# EAGLE design Firefly_Pendant (EAGLE 9.6.2)
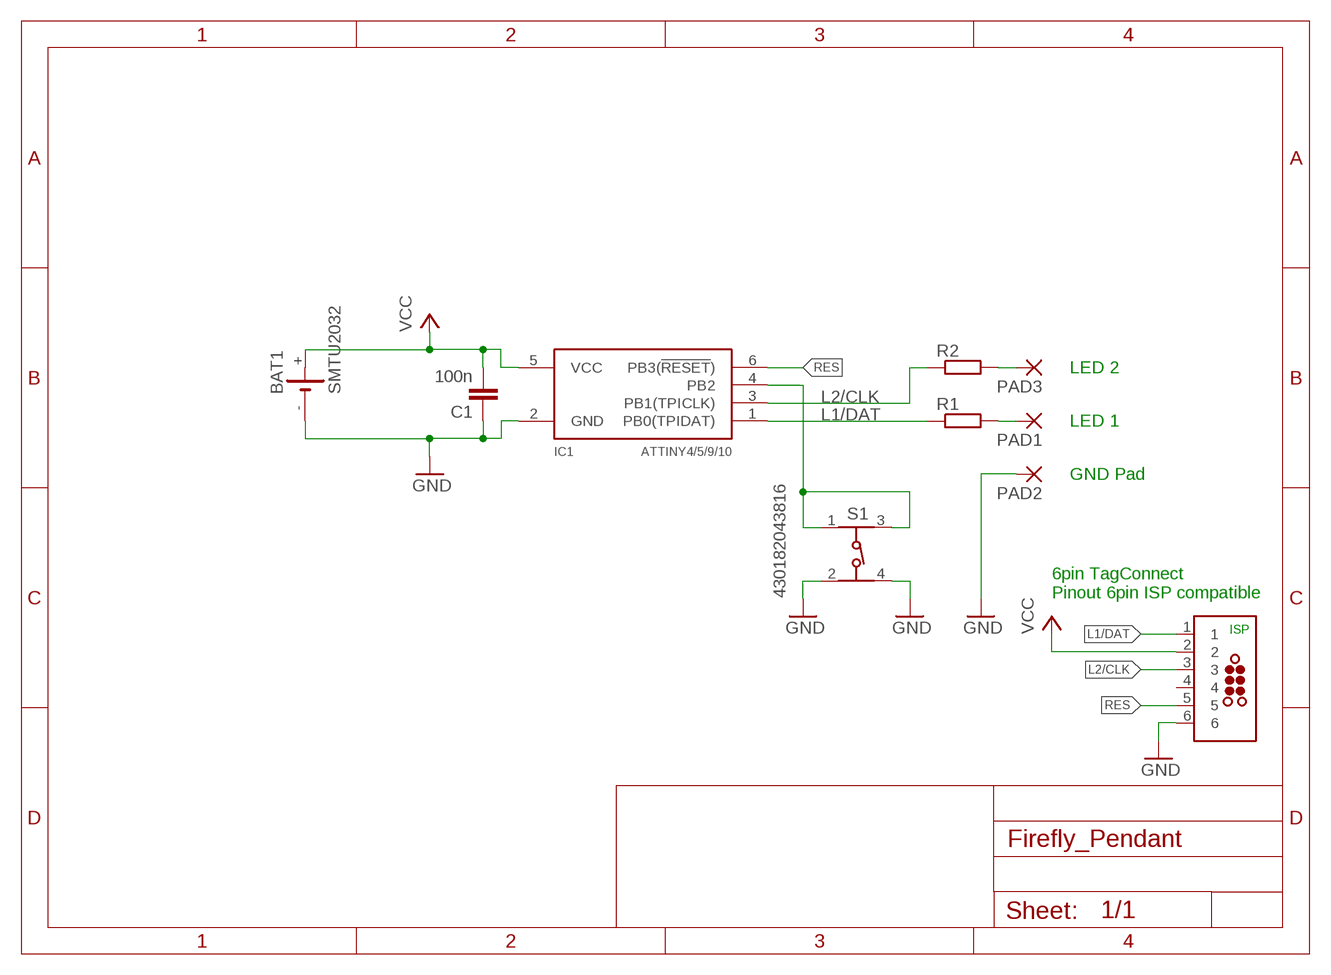
[diagram p0: schematic, sheet 1]

## Parts
BAT1  SMTU2032  [SMTU2032]
C1  100n  C-EUC0603  [C0603]
IC1  ATTINY4/5/9/10  [SOT23-6]
J1  TAG-CONNECT_TC2030-MCP-NL  [TAG-CONNECT_TC2030-MCP-NL]
PAD1  WIREPADSMD1,27-254  [SMD1,27-2,54]
PAD2  WIREPADSMD1,27-254  [SMD1,27-2,54]
PAD3  WIREPADSMD1,27-254  [SMD1,27-2,54]
R1  R-EU_R0603  [R0603]
R2  R-EU_R0603  [R0603]
S1  430182043816  [430182043816]

## Nets
GND: BAT1.- C1.1 IC1.2(GND) J1.6 PAD2.1(P) S1.2 S1.4
L1/DAT: IC1.1(PB0(TPIDAT)) J1.1 R1.1
L2/CLK: IC1.3(PB1(TPICLK)) J1.3 R2.1
N$1: PAD1.1(P) R1.2
N$3: IC1.4(PB2) S1.1 S1.3
N$5: PAD3.1(P) R2.2
RES: IC1.6(PB3(!RESET!)) J1.5
VCC: BAT1.+ C1.2 IC1.5(VCC) J1.2
Unconnected: J1.4

## Notes on the sheet
- LED 2
- LED 1
- GND Pad
- 6pin TagConnect
  Pinout 6pin ISP compatible
- ISP

## Library data of the parts
BAT1 = Eigene-Rietig:SMTU2032
C1 = rcl:C-EU: CAPACITOR, European symbol; SPICEPREFIX: C
IC1 = Eigene-Rietig:ATTINY4/5/9/10
J1 = Eigene-Rietig:TAG-CONNECT_TC2030: TAG-CONNECT ICSP Connector Manufacturer: Tag-Connect <http://www.tag-connect.com> Cable for easy In-Circuit Serial Programming. Designed for Microchip ICD2, suitable for many others. Two variants - one "with legs" (for hands-free fit on PCB) and another "without legs" for quick programming. PAD Description 1 MCLR/Vpp 2 Vdd 3 GND 4 PGD (ISPDAT) 5 PGC (ISPCLK) 6 nc (used for LVP) ©2009 ROFA.cz - modified and updated by Robert Darlington ‹rdarlington@gmail.com›
PAD1-PAD3 = wirepad:WIREPAD: Wire PAD connect wire on PCB
R1 R2 = rcl:R-EU_: RESISTOR, European symbol; SPICEPREFIX: R
S1 = Wurth_Switch_WS-TASV:430182043816: WS-TASV SMT Tact Switch 6x6 mm Material Properties Cover Material : Stainless Steel Properties Actuator Material:LCP Actuator Flammability :UL94 V-0 Rating Actuator Color:Black; Salmon; White Frame Material:LCP Flammability Rating:UL94 V-0 Frame Color:Black Contact Material:Stainless Steel Contact Plating:Silver Terminal Material:Copper Alloy Terminal Plating:Silver VR:12 V (DC) Contact Resistance Initial:100 mΩ Contact Resistance After Life Test:2Ω RISO:100 MΩ Withstanding Voltage:250 V (AC) Washable:No Qty.:4000;5000 Mechanical Properties Electrical Life:400; 550; 1000 Stroke :0.25 mm General Information Operating Temperature:-40 up to +85 °C Washable:No Packaging Properties Packaging:Tape and Reel <https://www.we-online.com/catalog/media/o37470v209%20Family_WS-TASV_6x6mm_SMD_Tact_Switch_4301820xx8xx.jpg> Details see: https://www.we-online.com/catalog/en/TASV_6X6_SMD/ Updated by yingchun,Shan;2020-02-18 2020(C) Würth Elektronik; DATASHEET-URL: https://www.we-online.com/redexpert/spec/430182043816?ae; HEIGHT: 4.3mm; OPERATION-FORCE: 160g; PART-NUMBER: 430182043816; QTY: 1000

## Board
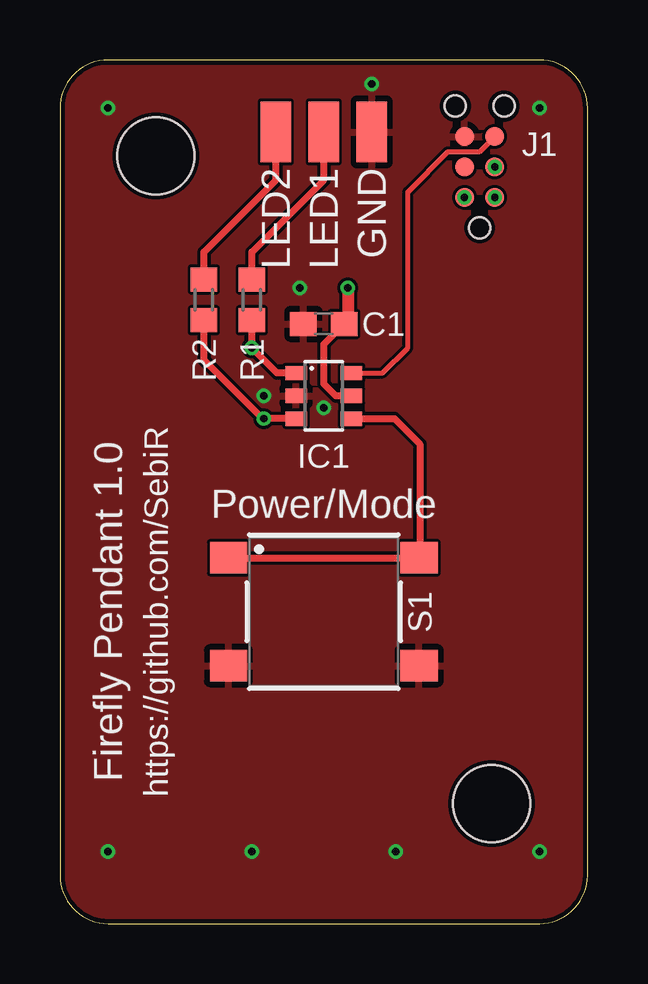
[diagram p1: board, top side]
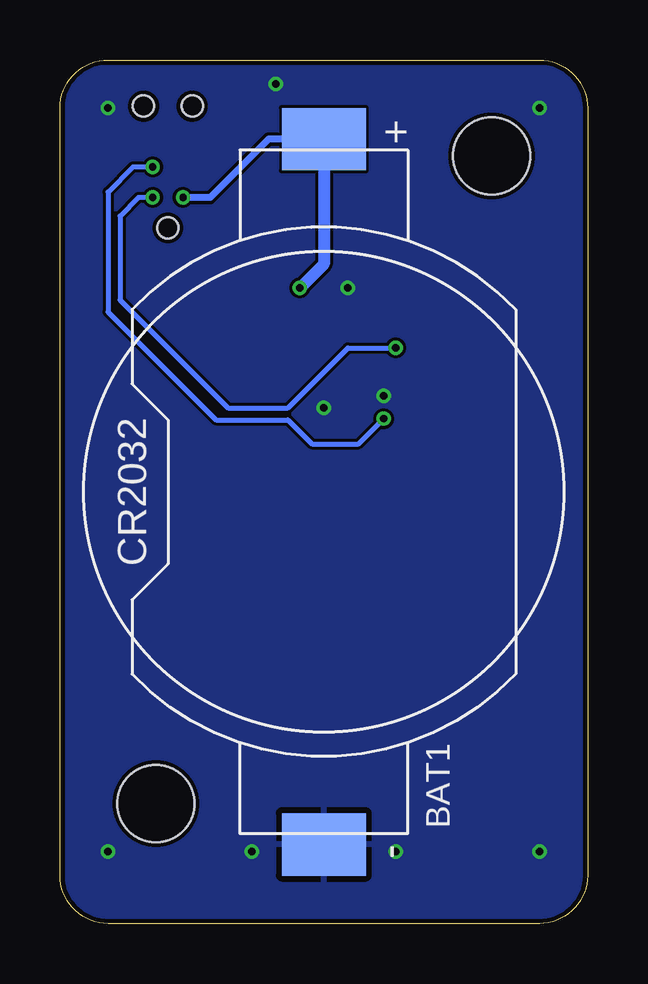
[diagram p2: board, bottom side, seen from below]

Size 22 x 36 mm. Coordinates in mm from the lower left corner, seen from the top.
Outline: 20,36 2,36 arc90 0,34 0,2 arc90 2,0 20,0 arc90 22,2 22,34 arc90 20,36
Copper layers (1*16): Top 0.035mm / dielectric 1.6mm / Bottom 0.035mm
Design rules "jlcpcb-2layers": minimum track width 0.2mm, minimum drill 0.3mm, track to track 5mil, track to pad 5mil, pad to pad 5mil, via to via 5mil, smd to smd 5mil, copper to edge 0.2mm, drill to drill 6mil, minimum pad ring 10mil, minimum via ring 0.125mm, stop-mask expansion 4mil, vias tented up to drill 0.5mm, thermal gap 10mil
Holes 3.2 mm at 4,32 18,5

### Footprints (pad centres in the part's own frame; a part is rotated, then mirrored left to right if it is on the bottom)
SMTU2032 = smd 2.6 x 3.5: + -14.7,0; - 14.7,0
C0603 = smd 1.1 x 1: 1 -0.85,0; 2 0.85,0
SOT23-6 = smd 0.6 x 0.9: 1 -0.95,-1.15; 2 0,-1.15; 3 0.95,-1.15; 4 0.95,1.15; 5 0,1.15; 6 -0.95,1.15
TAG-CONNECT_TC2030-MCP-NL = smd 0.787 x 0.787: 1 1.27,-0.635; 2 1.27,0.635; 3 2.54,-0.635; 4 2.54,0.635; 5 3.81,-0.635; 6 3.81,0.635 | hole 0.889: 0,0; 5.08,-1.016; 5.08,1.016
SMD1,27-2,54 = smd 1.27 x 2.54: 1 0,0
R0603 = smd 1 x 1.1: 1 -0.85,0; 2 0.85,0
430182043816 = smd 1.55 x 1.3: 1 -3.975,2.25; 2 -3.975,-2.25; 3 3.975,2.25; 4 3.975,-2.25

### Placement (x,y rotation side)
BAT1  11,18 270 bottom
C1  11,25 0 top
IC1  11,22 270 top
J1  17.5,29 90 top
PAD1  11,33 0 top
PAD2  13,33 0 top
PAD3  9,33 0 top
R1  8,26 90 top
R2  6,26 90 top
S1  11,13 0 top

### Tracks (layer width: path | path; a pad name or v marks a point on that pad's centre or on a via)
GND  (via drill 0.3 pad 0.6)
  other vias: 14,3 8,3 2,3 20,3 20,34 2,34 11,21.5 8.5,22 10,26.5 13,35
  pour Top: 0,2 0,34 arc-90 2,36 20,36 arc-90 22,34 22,2 arc-90 20,0 2,0 arc-90
  pour Bottom: 0,2 0,34 arc-90 2,36 20,36 arc-90 22,34 22,2 arc-90 20,0 2,0 arc-90
L1/DAT  (via drill 0.3 pad 0.6)
  Top 0.3: IC1.1 9.05,22.95 v8,24 R1.1
  Bottom 0.2: J1.1 18.73,30.27 19.5,29.5 19.5,26 15,21.5 12.5,21.5 10,24 v8,24
  other vias: 18.14,30.27
L2/CLK  (via drill 0.3 pad 0.6)
  Top 0.3: IC1.3 v8.5,21.05 8.45,21.05 6,23.5 R2.1
  Bottom 0.2: J1.3 18.96,31.54 20,30.5 20,25.5 15.5,21 12.5,21 11.5,20 9.55,20 v8.5,21.05
  other vias: 18.14,31.54
N$1
  Top 0.3: R1.2 8,28 11,31 PAD1.1
N$3
  Top 0.3: S1.1 S1.3 15,15.27 15,20 13.95,21.05 IC1.4
N$5
  Top 0.3: R2.2 6,28 9,31 PAD3.1
RES
  Top 0.2: J1.5 17.49,32.16 16.16,32.16 14.5,30.5 14.5,24 13.45,22.95 IC1.6
VCC  (via drill 0.3 pad 0.6)
  Top 0.3: IC1.5 11.5,22 11,22.5 11,24.15 C1.2
  Top 0.5: v12,26.5 12,25.15 C1.2
  Bottom 0.3: J1.2 15.73,30.27 13.3,32.7 BAT1.+
  Bottom 0.5: BAT1.+ 11,27.5 v12,26.5
  other vias: 16.86,30.27

### Text on the board
tPlace: LED2 | LED1 | GND | Power/Mode | Firefly Pendant 1.0 | https://github.com/SebiR